# EAGLE design 14 seg 0.5 8 digit (EAGLE 7.4.0)
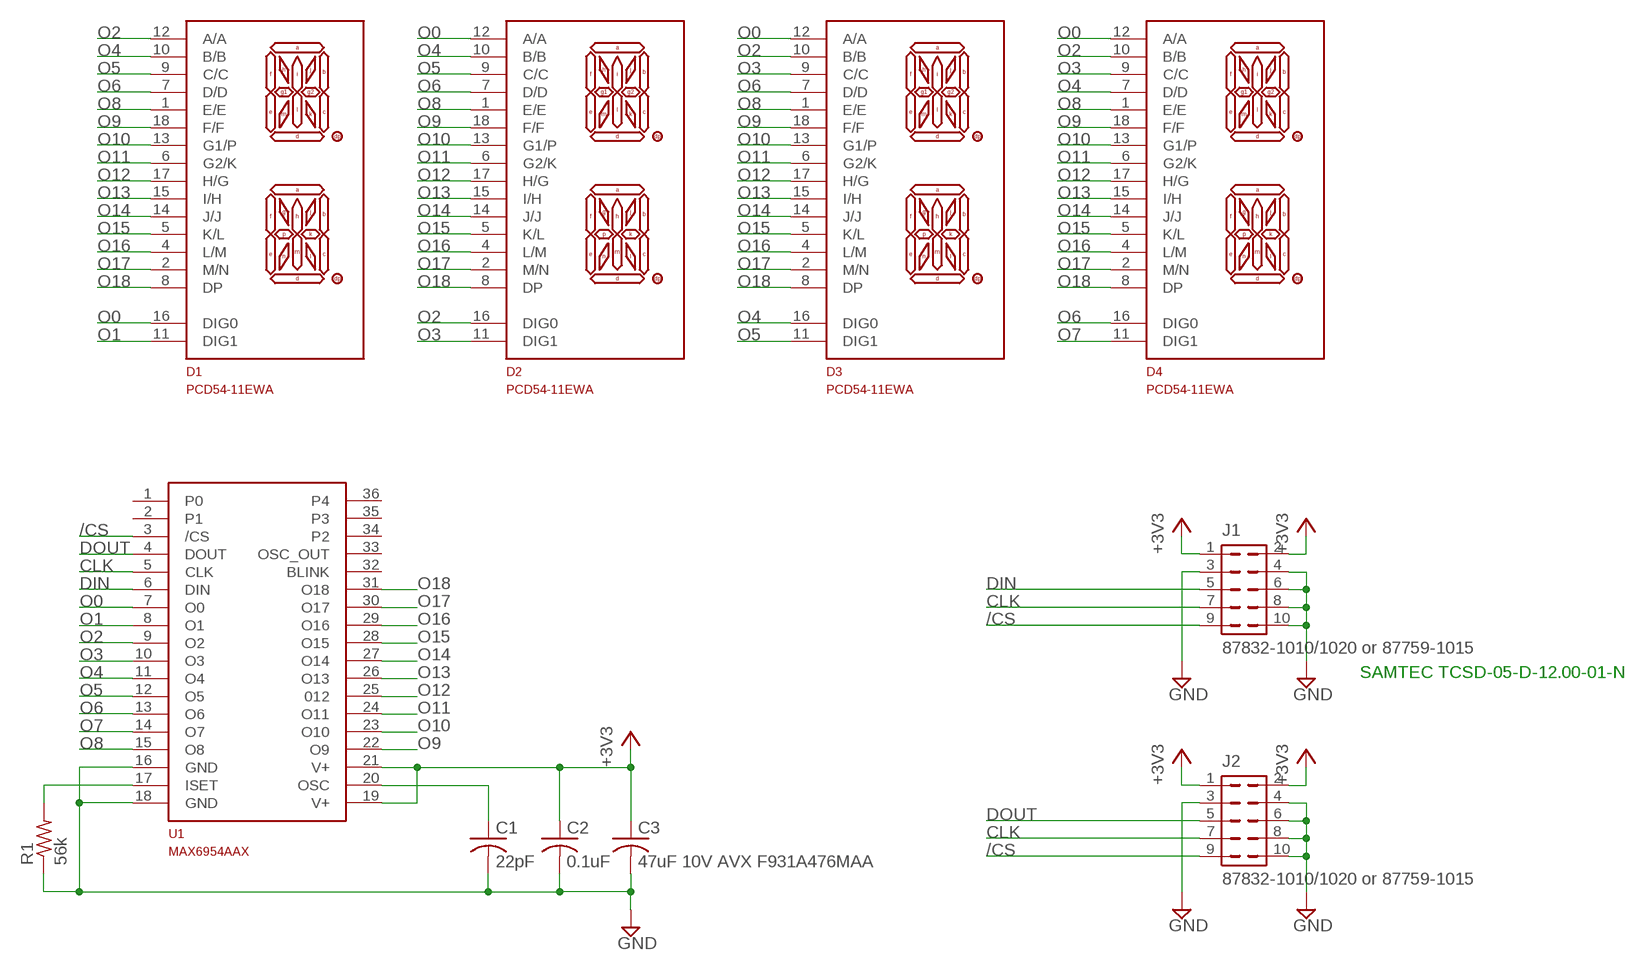
[diagram p0: schematic, sheet 1]

## Parts
C1  22pF  C-USC1206  [C1206]
C2  0.1uF  C-USC1206  [C1206]
C3  47uF 10V AVX F931A476MAA  C-USC1206  [C1206]
D1  PCD54-11EWA  [PDC54-11]
D2  PCD54-11EWA  [PDC54-11]
D3  PCD54-11EWA  [PDC54-11]
D4  PCD54-11EWA  [PDC54-11]
J1  87832-1010/1020 or 87759-1015  87832-10  [87832-10]
J2  87832-1010/1020 or 87759-1015  87832-10  [87832-10]
R1  56k  R-US_R1206  [R1206]
U1  MAX6954AAX  [MAXIM-0.8-SSOP36]

## Nets
+3V3: C2.1 C3.1 J1.1 J1.2 J2.1 J2.2 U1.19(V+) U1.21(V+)
/CS: J1.9 J2.9 U1.3(/CS)
CLK: J1.7 J2.7 U1.5(CLK)
CSET: C1.1 U1.20(OSC)
DIN: J1.5 U1.6(DIN)
DOUT: J2.5 U1.4(DOUT)
GND: C1.2 C2.2 C3.2 J1.3 J1.4 J1.6 J1.8 J1.10 J2.3 J2.4 J2.6 J2.8 J2.10 R1.1 U1.16(GND) U1.18(GND)
ISET: R1.2 U1.17(ISET)
O0: D1.16(DIG0) D2.12(A/A) D3.12(A/A) D4.12(A/A) U1.7(O0)
O1: D1.11(DIG1) U1.8(O1)
O2: D1.12(A/A) D2.16(DIG0) D3.10(B/B) D4.10(B/B) U1.9(O2)
O3: D2.11(DIG1) D3.9(C/C) D4.9(C/C) U1.10(O3)
O4: D1.10(B/B) D2.10(B/B) D3.16(DIG0) D4.7(D/D) U1.11(O4)
O5: D1.9(C/C) D2.9(C/C) D3.11(DIG1) U1.12(O5)
O6: D1.7(D/D) D2.7(D/D) D3.7(D/D) D4.16(DIG0) U1.13(O6)
O7: D4.11(DIG1) U1.14(O7)
O8: D1.1(E/E) D2.1(E/E) D3.1(E/E) D4.1(E/E) U1.15(O8)
O9: D1.18(F/F) D2.18(F/F) D3.18(F/F) D4.18(F/F) U1.22(O9)
O10: D1.13(G1/P) D2.13(G1/P) D3.13(G1/P) D4.13(G1/P) U1.23(O10)
O11: D1.6(G2/K) D2.6(G2/K) D3.6(G2/K) D4.6(G2/K) U1.24(O11)
O12: D1.17(H/G) D2.17(H/G) D3.17(H/G) D4.17(H/G) U1.25
O13: D1.15(I/H) D2.15(I/H) D3.15(I/H) D4.15(I/H) U1.26(O13)
O14: D1.14(J/J) D2.14(J/J) D3.14(J/J) D4.14(J/J) U1.27(O14)
O15: D1.5(K/L) D2.5(K/L) D3.5(K/L) D4.5(K/L) U1.28(O15)
O16: D1.4(L/M) D2.4(L/M) D3.4(L/M) D4.4(L/M) U1.29(O16)
O17: D1.2(M/N) D2.2(M/N) D3.2(M/N) D4.2(M/N) U1.30(O17)
O18: D1.8(DP) D2.8(DP) D3.8(DP) D4.8(DP) U1.31(O18)
Unconnected: U1.1(P0) U1.2(P1) U1.32(BLINK) U1.33(OSC_OUT) U1.34(P2) U1.35(P3) U1.36(P4)

## Notes on the sheet
- SAMTEC TCSD-05-D-12.00-01-N

## Library data of the parts
C1-C3 = rcl:C-US: CAPACITOR, American symbol
D1-D4 = GlenPartsLibrary:PCD54-11EWA
J1 J2 = con-molex:87832-10: Milli-Grid Header 2.00mm (.079") Pitch; OC_FARNELL: unknown; OC_NEWARK: unknown
R1 = rcl:R-US_: RESISTOR, American symbol
U1 = GlenPartsLibrary:MAX6954AAX

## Board
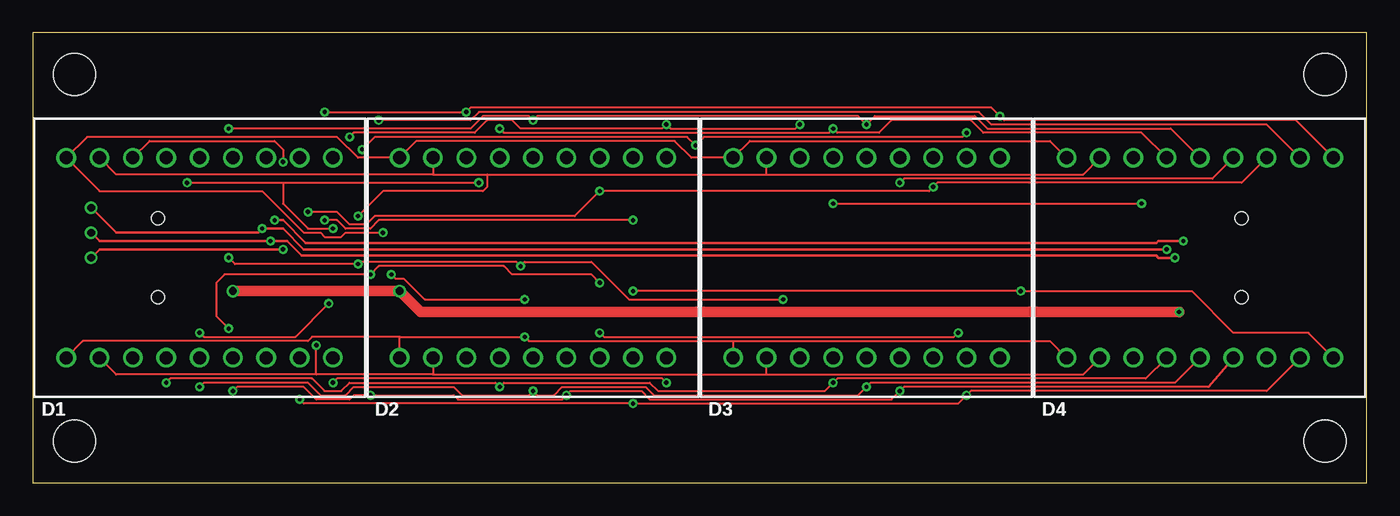
[diagram p1: board, top side]
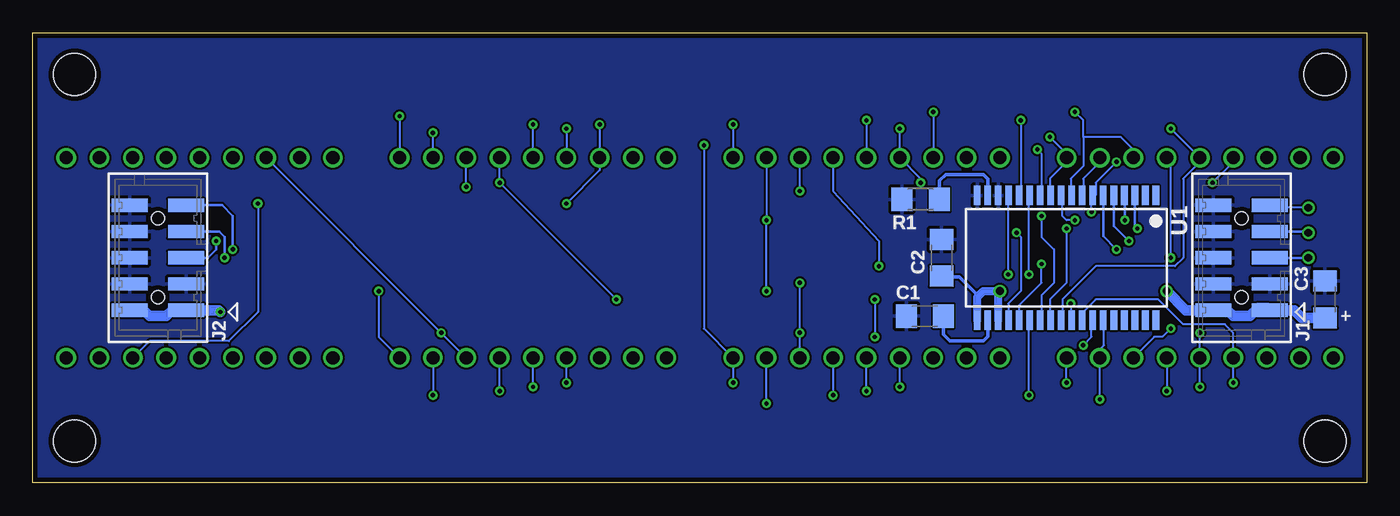
[diagram p2: board, bottom side, seen from below]

Size 101.6 x 34.29 mm. Coordinates in mm from the lower left corner, seen from the top.
Outline: 0,0 101.6,0 101.6,34.29 0,34.29 0,0
Copper layers (1*16): Top 0.0356mm / dielectric 1.5011mm / Bottom 0.0356mm
Design rules "oshpark-2layer": minimum track width 6mil, minimum drill 13mil, track to track 6mil, track to pad 6mil, pad to pad 6mil, via to via 6mil, smd to smd 6mil, copper to edge 15mil, drill to drill 6mil, minimum pad ring 7mil, minimum via ring 7mil, stop-mask expansion 2.5mil, vias tented up to drill 0mil, thermal gap 10mil
Holes 3.2 mm at 3.17,3.17 98.42,3.17 98.42,31.11 3.17,31.11

### Footprints (pad centres in the part's own frame; a part is rotated, then mirrored left to right if it is on the bottom)
C1206 = smd 1.6 x 1.8: 1 -1.4,0; 2 1.4,0
PDC54-11 = drill 1: 1 -10.16,-7.62; 2 -7.62,-7.62; 3 -5.08,-7.62; 4 -2.54,-7.62; 5 0,-7.62; 6 2.54,-7.62; 7 5.08,-7.62; 8 7.62,-7.62; 9 10.16,-7.62; 10 10.16,7.62; 11 7.62,7.62; 12 5.08,7.62; 13 2.54,7.62; 14 0,7.62; 15 -2.54,7.62; 16 -5.08,7.62; 17 -7.62,7.62; 18 -10.16,7.62
87832-10 = smd 1 x 2.75: 1 -4,-2.15; 2 -4,2.15; 3 -2,-2.15; 4 -2,2.15; 5 0,-2.15; 6 0,2.15; 7 2,-2.15; 8 2,2.15; 9 4,-2.15; 10 4,2.15 | hole 1: -3,0; 3,0
R1206 = smd 1.6 x 1.803: 1 -1.422,0; 2 1.422,0
MAXIM-0.8-SSOP36 = smd 0.5 x 1.5: 1 -6.8,-4.75; 2 -6,-4.75; 3 -5.2,-4.75; 4 -4.4,-4.75; 5 -3.6,-4.75; 6 -2.8,-4.75; 7 -2,-4.75; 8 -1.2,-4.75; 9 -0.4,-4.75; 10 0.4,-4.75; 11 1.2,-4.75; 12 2,-4.75; 13 2.8,-4.75; 14 3.6,-4.75; 15 4.4,-4.75; 16 5.2,-4.75; 17 6,-4.75; 18 6.8,-4.75; 19 6.8,4.75; 20 6,4.75; 21 5.2,4.75; 22 4.4,4.75; 23 3.6,4.75; 24 2.8,4.75; 25 2,4.75; 26 1.2,4.75; 27 0.4,4.75; 28 -0.4,4.75; 29 -1.2,4.75; 30 -2,4.75; 31 -2.8,4.75; 32 -3.6,4.75; 33 -4.4,4.75; 34 -5.2,4.75; 35 -6,4.75; 36 -6.8,4.75

### Placement (x,y rotation side)
C1  33.66,12.7 180 bottom
C2  32.38,17.14 90 bottom
C3  3.17,13.97 90 bottom
D1  12.7,17.14 0 top
D2  38.1,17.14 0 top
D3  63.5,17.14 0 top
D4  88.9,17.14 0 top
J1  9.53,17.14 90 bottom
J2  92.08,17.14 90 bottom
R1  33.97,21.59 0 bottom
U1  22.86,17.14 180 bottom

### Tracks (layer width: path | path; a pad name or v marks a point on that pad's centre or on a via)
+3V3  (via drill 0.33, 0.6)
  Top 0.813: v15.24,14.61 v27.94,14.61 29.53,13.02 v87.31,13.02
  Bottom 0.152: 32.26,15.7 C2.1
  Bottom 0.254: 32.26,15.7 31.04,15.7 29.58,14.24
  Bottom 0.406: 28.06,14.48 v27.94,14.61
  Bottom 0.61: U1.19 29.66,14.15 29.58,14.24 29.21,14.61 v27.94,14.61 | U1.21 28.06,14.48 | J2.1 89.98,13.14 90.17,13.34 | 94.1,13.02 J2.2
  Bottom 0.813: C3.1 4.95,12.57 5.53,13.14 J1.1 7.57,13.34 8.26,13.34 8.89,12.7 10.16,12.7 10.61,13.14 J1.2 13.78,13.14 v15.24,14.61 | 94.1,13.02 93.03,13.02 92.71,12.7 91.44,12.7 91,13.14 J2.1 87.44,13.14 v87.31,13.02
/CS  (via drill 0.33, 0.6)
  Top 0.203: v4.45,20.95 6.35,19.05 17.14,19.05 v17.46,19.37 19.05,19.37 20.64,17.78 v86.36,17.78
  Bottom 0.152: v4.45,20.95 7.3,20.95 J1.9
  Bottom 0.203: U1.3 17.66,19.57 v17.46,19.37 | J2.9 87.19,21.14 86.36,20.32 v86.36,17.78
CLK  (via drill 0.33, 0.6)
  Top 0.203: v4.45,19.05 5.08,18.41 v18.1,18.41 19.37,18.41 20.48,17.3 85.57,17.3 85.72,17.14 v87,17.14
  Bottom 0.203: J1.7 4.54,19.14 v4.45,19.05 | U1.5 19.26,19.58 v18.1,18.41 | J2.7 87.41,19.14 87,18.73 v87,17.14
CSET
  Bottom 0.254: U1.20 28.86,11.14 29.21,10.79 31.75,10.79 32.26,11.3 C1.1
DIN  (via drill 0.33, 0.6)
  Top 0.203: v4.45,17.14 5.08,17.78 v19.05,17.78
  Bottom 0.203: J1.5 v4.45,17.14 | U1.6 20.06,18.79 v19.05,17.78
DOUT  (via drill 0.33)
  Top 0.203: v18.41,20 19.05,20 20.8,18.26 85.57,18.26 85.72,18.41 87.31,18.41 v87.63,18.41
  Bottom 0.152: 18.41,21.85 U1.4
  Bottom 0.203: v18.41,20 18.41,21.85 | J2.5 88.27,17.14 87.63,17.78 v87.63,18.41
GND
  pour Bottom (isolate 0.152): 0,34.29 0,0 101.6,0 101.6,34.29
ISET
  Bottom 0.254: U1.17 28.86,23.14 29.21,23.5 32.07,23.5 32.55,23.01 R1.2
O0  (via drill 0.33)
  Top 0.152: v19.05,24.45 19.05,25.4 18.41,26.04 8.89,26.04 D1.16 | D4.12 92.08,22.86 68.9,22.86 v68.58,22.54 68.26,22.23 v43.18,22.23 41.27,20.32 26.04,20.32 25.4,19.68 24.13,19.68 23.18,20.64 v20.95,20.64
  Bottom 0.152: v19.05,24.45 20.64,22.86 20.64,21.91 U1.7 20.95,21.59 v20.95,20.64 | v43.18,22.23 D2.12 | v68.58,22.54 D3.12
O1
  Bottom 0.152: D1.11 20.32,24.45 21.59,23.18 21.59,21.91 U1.8
O2  (via drill 0.33)
  Top 0.152: v22.23,28.26 v33.02,28.26 33.34,28.57 73.03,28.57 v73.66,27.94 73.98,27.62 96.2,27.62 D4.10
  Bottom 0.152: 21.59,26.35 21.59,24.13 22.54,23.18 22.54,21.91 U1.9 | 21.59,26.35 18.73,26.35 17.78,25.4 D1.12 | v33.02,28.26 D2.16 | 21.59,26.35 21.59,27.62 v22.23,28.26 | v73.66,27.94 D3.10
O3  (via drill 0.33)
  Top 0.152: v22.23,20 23.18,20 23.81,19.37 25.72,19.37 26.35,20 v45.72,20 | v45.72,14.61 v75.25,14.61 88.27,14.61 91.44,11.43 97.16,11.43 D4.9
  Bottom 0.152: v22.23,20 22.86,20 23.18,20.32 23.18,21.59 U1.10 | D2.11 v45.72,20 v45.72,14.61 | v75.25,14.61 75.25,11.11 D3.9
O4  (via drill 0.33)
  Top 0.152: v60.96,21.27 v84.45,21.27 | v24.13,26.35 24.45,26.67 33.66,26.67 34.61,27.62 36.51,27.62 37.15,26.99 47.94,26.99 v48.26,27.3 48.58,26.99 58.1,26.99 v58.42,27.3
  Bottom 0.152: U1.11 24.13,21.91 24.13,23.18 22.86,24.45 D1.10 22.86,25.08 v24.13,26.35 | v48.26,27.3 D2.10 | v84.45,21.27 84.45,13.02 86.68,10.79 92.71,10.79 D4.7 | v60.96,21.27 58.42,23.81 D3.16 v58.42,27.3
O5  (via drill 0.33)
  Top 0.152: v22.86,7.62 23.18,7.94 47.94,7.94 v48.26,7.62 | v25.08,25.4 26.04,26.35 49.85,26.35 v50.48,25.72 51.12,26.35 70.8,26.35 v71.12,26.67
  Bottom 0.152: v22.86,7.62 D1.9 | v48.26,7.62 D2.9 50.48,11.75 v50.48,25.72 | v25.08,25.4 24.77,25.08 24.77,21.91 U1.12 | D3.11 v71.12,26.67
O6  (via drill 0.33)
  Top 0.152: v43.18,15.24 42.55,15.88 36.51,15.88 35.88,16.51 26.35,16.51 v25.72,15.88 14.61,15.88 13.97,15.24 13.97,12.7 v14.92,11.75 | v70.48,11.43 70.17,11.11 43.5,11.11 v43.18,11.43
  Bottom 0.152: D4.16 v70.48,11.43 D3.7 | v25.72,15.88 25.72,21.59 U1.13 | v43.18,15.24 v43.18,11.43 D2.7 | D1.7 16.19,11.11 15.56,11.11 v14.92,11.75
O7  (via drill 0.33)
  Top 0.152: v26.35,27.62 33.34,27.62 33.97,28.26 72.07,28.26 73.03,27.3 93.98,27.3 D4.11
  Bottom 0.152: v26.35,27.62 26.35,21.91 U1.14
O8  (via drill 0.33)
  Top 0.152: v27.3,15.88 27.62,15.56 28.26,15.56 29.84,13.97 v37.47,13.97 | D2.1 27.94,11.11 | D1.1 3.81,10.79 20.95,10.79 21.27,11.11 27.94,11.11 | 53.34,10.79 D3.1 | 27.94,11.11 v37.47,11.11 37.78,10.79 53.34,10.79 | D4.1 77.47,10.79 53.34,10.79
  Bottom 0.152: v27.3,15.88 27.3,21.59 U1.15 | v37.47,13.97 v37.47,11.11
O9  (via drill 0.33)
  Top 0.152: v26.67,19.05 23.81,19.05 23.5,18.73 22.23,18.73 21.91,19.05 20.64,19.05 17.46,22.23 5.08,22.23 D1.18 4.13,26.35 23.18,26.35 24.77,24.77 D2.18 29.21,26.04 48.9,26.04 50.16,24.77 D3.18 54.61,26.04 77.47,26.04 D4.18
  Bottom 0.152: v26.67,19.05 26.35,18.73 26.35,14.61 27.3,13.65 27.3,12.7 U1.22
O10  (via drill 0.33)
  Top 0.152: v66.04,22.86 66.36,23.18 89.85,23.18 D4.13 | v14.92,17.14 15.4,16.67 v24.77,16.67 24.92,16.83 36.83,16.83 v37.15,16.51 37.47,16.83 42.55,16.83 45.4,13.97 v57.15,13.97
  Bottom 0.152: D3.13 v66.04,22.86 v57.15,13.97 | v37.15,16.51 37.15,18.41 40.64,22.23 D2.13 | 26.35,12.38 U1.23 26.46,13.54 24.77,15.24 v24.77,16.67 | D1.13 14.92,24.45 v14.92,17.14
O11  (via drill 0.33)
  Top 0.152: D4.6 89.53,7.3 66.36,7.3 v66.04,6.99 65.41,6.35 46.99,6.35 46.35,6.99 40.96,6.99 v40.64,6.67 40.32,6.35 32.38,6.35 32.07,6.67 v25.72,6.67 24.45,6.67 24.13,6.35 21.59,6.35 20.64,7.3 15.56,7.3 v15.24,6.99
  Bottom 0.152: v66.04,6.99 D3.6 | v25.72,6.67 25.72,12.38 U1.24 | D1.6 v15.24,6.99 | D2.6 v40.64,6.67
O12  (via drill 0.33)
  Top 0.152: v24.77,20.32 26.67,22.23 34.29,22.23 34.61,22.54 34.61,23.5 | 30.48,23.5 34.61,23.5 | D2.17 30.48,23.5 | D1.17 6.35,23.5 30.48,23.5 | 55.88,23.5 D3.17 | 34.61,23.5 55.88,23.5 | D4.17 80.01,23.5 55.88,23.5
  Bottom 0.152: v24.77,20.32 24.77,18.73 23.81,17.78 23.81,15.24 24.77,14.29 24.77,12.7 U1.25
O13  (via drill 0.33)
  Top 0.152: D4.15 84.45,26.67 72.39,26.67 71.44,27.62 65.41,27.62 64.45,26.67 61.28,26.67 v60.96,26.99 60.64,26.67 35.88,26.67 v35.56,26.99 | v22.86,19.37 20.95,19.37 19.05,21.27 19.05,22.86 | v11.75,22.86 19.05,22.86 | 19.05,22.86 v33.97,22.86
  Bottom 0.152: v60.96,26.99 D3.15 | v22.86,19.37 22.86,15.24 24.13,13.97 24.13,12.7 U1.26 | v11.75,22.86 10.16,24.45 D1.15 | v33.97,22.86 33.97,23.18 D2.15 v35.56,26.99
O14  (via drill 0.33)
  Top 0.152: D4.14 86.68,26.99 72.71,26.99 71.75,27.94 64.14,27.94 v63.5,27.3 62.87,27.94 38.42,27.94 v38.1,27.62 37.78,27.94 34.29,27.94 33.34,26.99 v14.92,26.99
  Bottom 0.152: U1.27 23.18,12.7 23.18,13.97 20.64,16.51 14.61,16.51 13.97,17.14 13.97,23.18 12.7,24.45 D1.14 v14.92,26.99 | v38.1,27.62 D2.14 | D3.14 v63.5,27.3
O15  (via drill 0.33)
  Top 0.152: v22.54,13.65 20,11.11 13.02,11.11 v12.7,11.43 | D4.5 87,7.62 63.82,7.62 v63.5,7.3 62.87,6.67 47.31,6.67 46.67,7.3 40.32,7.3 39.69,6.67 38.42,6.67 v38.1,6.99 37.78,6.67 32.7,6.67 32.07,7.3 24.45,7.3 23.81,6.67 21.91,6.67 20.95,7.62 13.02,7.62 v12.7,7.3
  Bottom 0.152: v22.54,13.65 22.54,12.7 U1.28 | v12.7,11.43 D1.5 v12.7,7.3 | v38.1,6.99 D2.5 | v63.5,7.3 D3.5
O16  (via drill 0.33)
  Top 0.152: D4.4 84.77,7.94 61.28,7.94 v60.96,7.62 60.33,6.99 47.62,6.99 46.99,7.62 35.88,7.62 v35.56,7.3 35.24,7.62 24.13,7.62 23.5,6.99 22.23,6.99 21.27,7.94 10.48,7.94 v10.16,7.62
  Bottom 0.152: v60.96,7.62 D3.4 | U1.29 21.59,12.7 21.59,13.02 20.64,13.97 15.88,13.97 13.97,12.06 10.79,12.06 10.16,11.43 D1.4 v10.16,7.62 | v35.56,7.3 D2.4
O17  (via drill 0.33)
  Top 0.152: 21.59,8.26 v21.59,10.48 | 30.48,8.26 21.59,8.26 | D2.2 30.48,8.26 | D1.2 6.35,8.26 21.59,8.26 | 55.88,8.26 D3.2 | 30.48,8.26 55.88,8.26 | D4.2 80.01,8.26 55.88,8.26
  Bottom 0.152: v21.59,10.48 20.95,11.11 20.95,12.38 U1.30
O18  (via drill 0.33)
  Top 0.152: v20.32,6.35 20.64,6.03 v45.72,6.03 70.48,6.03 v71.12,6.67 71.44,6.99 93.98,6.99 D4.8
  Bottom 0.152: U1.31 20,12.38 20,10.48 20.32,10.16 D1.8 v20.32,6.35 | v45.72,6.03 D2.8 | v71.12,6.67 D3.8 71.12,9.84

### Text on the board
_tsilk: D1 | D2 | D3 | D4
_bsilk: U1 | R1 | C2 | C3 | C1 | + | J1 | J2